# Altium project CopterControl Mag & Pressure.PrjPcb
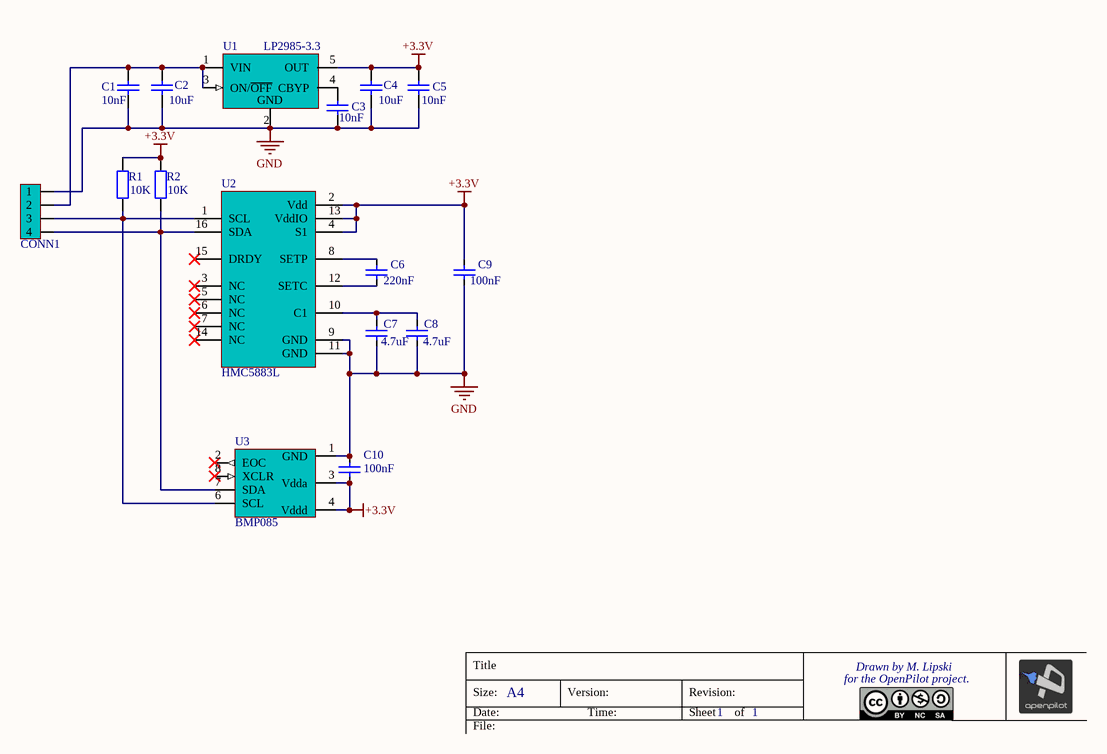
[diagram p0: CopterControl Mag & Pressure.SchDoc]
1 sheet, 16 parts. Net scope: global (net labels, ports and power ports of the same name join across sheets).
Board file: CopterControl Mag & Pressure.PcbDoc

## Sheet CopterControl Mag & Pressure.SchDoc: CopterControl Mag & Pressure
size A4; ApprovedBy: David Ankers; CheckedBy: David Ankers; Author: Matt Lipski; CompanyName: The OpenPilot Project; Engineer: Matt Lipski; Organization: The OpenPilot Project; DocumentNumber: 1; Revision: A; License: Creative Common BY-NC-SA; DocumentName: CopterControl Mag & Pressure

### Parts
C1  value 10nF  [CAP603L]  (hidden comment: Cap603)
C2  value 10uF  [CAP805L]  (hidden comment: Cap805)
C3  value 10nF  [CAP603L]  (hidden comment: Cap603)
C4  value 10uF  [CAP805L]  (hidden comment: Cap805)
C5  value 10nF  [CAP603L]  (hidden comment: Cap603)
C6  value 220nF  [CAP603L]  (hidden comment: Cap603)
C7  value 4.7uF  [CAP603L]  (hidden comment: Cap603)
C8  value 4.7uF  [CAP603L]  (hidden comment: Cap603)
C9  value 100nF  [CAP603L]  (hidden comment: Cap603)
C10  value 100nF  [CAP603L]  (hidden comment: Cap603)
CONN1  JST-SH 4-pin Side Entry Socket  [JST SH 4 Pin Side Entry]  (value not drawn)
R1  value 10K  [RES603N]  (hidden comment: Res603)
R2  value 10K  [RES603N]  (hidden comment: Res603)
U1  LP2985-3.3  [SOT23-5L]
U2  HMC5883L  [LPCC-16]
U3  BMP085  [BMP085]

### Nets
+3.3V: C4.1 C5.1 C9.1 C10.1 R1.2 R2.2 U1.5(OUT) U2.2(Vdd) U2.4(S1) U2.13(VddIO) U3.3(Vdda) U3.4(Vddd)
GND: C1.2 C2.2 C3.2 C4.2 C5.2 C7.2 C8.2 C9.2 C10.2 CONN1.1 U1.2(GND) U2.9(GND) U2.11(GND) U3.1(GND)
NetC1_1: C1.1 C2.1 CONN1.2 U1.1(VIN) U1.3(ON/~{OFF})
NetC3_1: C3.1 U1.4(CBYP)
NetC6_1: C6.1 U2.12(SETC)
NetC6_2: C6.2 U2.8(NC)
NetC7_1: C7.1 C8.1 U2.10(C1)
NetCONN1_3: CONN1.3 R1.1 U2.1(SCL) U3.6(SCL)
NetCONN1_4: CONN1.4 R2.1 U2.16(SDA) U3.7(SDA)

Not connected (* = marked no-connect by the designer): U2 3(NC)* 5(NC)* 6(NC)* 7(NC)* 14(NC)* 15(DRDY)*; U3 2(EOC)* 5(NC) 8(XCLR)*

### Notes on the sheet
- Title
- Size:
- Date:
- A4
- Version:
- Time:
- Revision:
- Sheet
- 1
- of
- for the OpenPilot project.
- Drawn by M. Lipski
- File:

### Library data of the parts
C1 C3 C5-C10 = Cap603: Capacitor SMD; Published: 1-Nov-2010; LatestRevisionDate: 1-Nov-2010; LatestRevisionNote: Released OpenPilot Lib; PackageReference: 0603 (1608 Metric); Publisher: The OpenPilot Project; Supplier 1: Digi-Key
  C1 C3 C5: Supplier Part Number 1: 399-1091-1-ND
  C6: Supplier Part Number 1: 445-5148-1-ND
  C7 C8: Supplier Part Number 1: 445-5178-1-ND
  C9 C10: Supplier Part Number 1: 399-5089-1-ND
C2 C4 = Cap805: Capacitor SMD; Published: 1-Nov-2010; LatestRevisionDate: 1-Nov-2010; LatestRevisionNote: Released OpenPilot Lib; PackageReference: 0805 (2012 Metric); Publisher: The OpenPilot Project; Supplier 1: Digi-Key; Supplier Part Number 1: 490-3886-1-ND
CONN1 = JST-SH 4-pin Side Entry Socket: Manufacturer: Generic Components; Class: Connector; Supplier 1: Digi-Key; Supplier Part Number 1: 455-1804-1-ND; ComponentLink2Description: Datasheet; LatestRevisionDate: 1-Nov-2010; LatestRevisionNote: Released OpenPilot Lib; Published: 1-Nov-2010; Publisher: The OpenPilot Project
R1 R2 = Res603: Resistor SMD; Published: 1-Nov-2010; LatestRevisionDate: 1-Nov-2010; LatestRevisionNote: Released OpenPilot Lib; PackageReference: 0402 (1005 Metric); Publisher: The OpenPilot Project; Supplier 1: Digi-Key; Supplier Part Number 1: P10.0KHCT-ND
U1 = LP2985-3.3: 3.3V 150mA LDO Regulator; Supplier 1: Digi-Key; Supplier Part Number 1: 296-18479-1-ND
U2 = HMC5883L: IC, Magnetometer, 3 axis, +/- 8 Oe, I2C, 160Hz; Manufacturer: Honeywell; Supplier 1: Digi-Key; Supplier Part Number 1: 342-1082-1-ND; ComponentLink2Description: Datasheet; LatestRevisionDate: 13 Jan 2011; LatestRevisionNote: Initial version; Published: 13 Jan 2011; Publisher: The OpenPilot Project; ManufacturerPartNo: HMC5883L; Value: HMC5883L
U3 = BMP085: Barometric Pressure Sensor; Supplier 1: Digi-Key; Supplier Part Number 1: 828-1005-1-ND